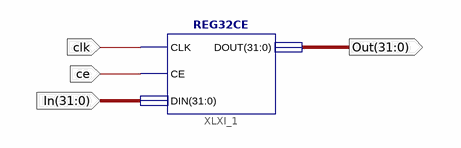
[diagram p0: schematic sheet 1]
// Xilinx ISE schematic REG_B.sch (spartan6) as structural Verilog: 1 symbols, 4 ports
module REG_B (
  input  clk,
  input  ce,
  input  [31:0] In,
  output [31:0] Out
);

  REG32CE XLXI_1 (.CLK(clk), .CE(ce), .DIN(In), .DOUT(Out));
endmodule
